# Altium schematic sheet Sheet_1_2020-11-27_13-26-31.schdoc
size 111 x 42 mm
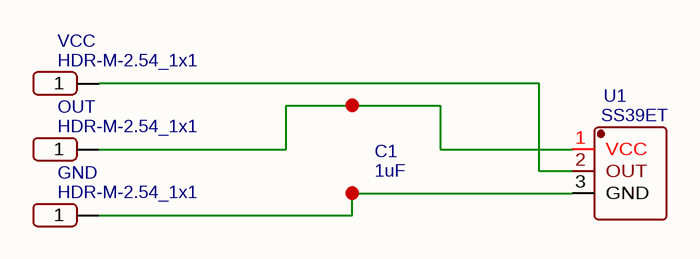
[diagram p0: Sheet_1_2020-11-27_13-26-31.schdoc]

## Parts
C1  1uF  [0402]
GND  HDR-M-2.54_1x1  [HDR-M-2.54_1X1]
OUT  HDR-M-2.54_1x1  [HDR-M-2.54_1X1]
U1  SS39ET  [SOT-23-3_L2.9-W1.3-P1.90-LS2.4-BR]
VCC  HDR-M-2.54_1x1  [HDR-M-2.54_1X1]

## Nets
NetGND_1: GND.1 U1.3(GND)
NetOUT_1: OUT.1 U1.1(VCC)
NetU1_2: U1.2(OUT) VCC.1

## Library data of the parts
C1 = 1uF: BOM_Manufacturer: AVX; BOM_Manufacturer Part: 04026D105KAT2A; nameAlias: Capacitance; Contributor: LCSC; BOM_Supplier: LCSC; BOM_Supplier Part: C165204; spicePre: C; spiceSymbolName: Capacitor, 1uF, 0402
GND OUT VCC = HDR-M-2.54_1x1: Contributor: LCEDA_Lib; BOM_Supplier Part: C81276; BOM_Supplier: LCSC; spicePre: J; spiceSymbolName: HDR-M-2.54_1x1
U1 = SS39ET: BOM_Manufacturer: Honeywell; Contributor: LCSC; SMT Type: Extend; BOM_Supplier: LCSC; BOM_Manufacturer Part: SS39ET; BOM_Supplier Part: C126669; BOM_JLCPCB SMD: Yes; spicePre: U; spiceSymbolName: SS39ET